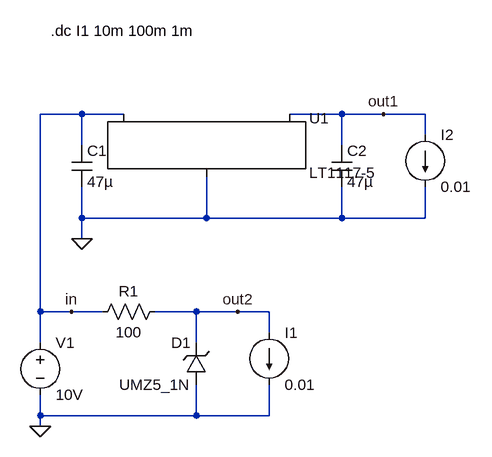
[diagram p0: schematic 08-regulator_vs_zener.asc]
08-regulator_vs_zener.asc, the LTspice schematic file:
Version 4
SHEET 1 880 680
WIRE -16 64 -80 64
WIRE 48 64 -16 64
WIRE 384 64 304 64
WIRE 448 64 384 64
WIRE 512 64 448 64
WIRE 512 96 512 64
WIRE -16 112 -16 64
WIRE 384 112 384 64
WIRE -16 224 -16 176
WIRE 176 224 176 160
WIRE 176 224 -16 224
WIRE 384 224 384 176
WIRE 384 224 176 224
WIRE 512 224 512 176
WIRE 512 224 384 224
WIRE -16 256 -16 224
WIRE -80 368 -80 64
WIRE -32 368 -80 368
WIRE 16 368 -32 368
WIRE 160 368 96 368
WIRE 224 368 160 368
WIRE 272 368 224 368
WIRE 272 400 272 368
WIRE -80 416 -80 368
WIRE 160 416 160 368
WIRE -80 528 -80 496
WIRE 160 528 160 480
WIRE 160 528 -80 528
WIRE 272 528 272 480
WIRE 272 528 160 528
WIRE -80 544 -80 528
FLAG -80 544 0
FLAG -32 368 in
FLAG 448 64 out1
FLAG -16 256 0
FLAG 224 368 out2
SYMBOL res 112 352 R90
WINDOW 0 0 56 VBottom 2
WINDOW 3 32 56 VTop 2
SYMATTR InstName R1
SYMATTR Value 100
SYMBOL voltage -80 400 R0
WINDOW 123 0 0 Left 0
WINDOW 39 0 0 Left 0
SYMATTR InstName V1
SYMATTR Value 10V
SYMBOL zener 176 480 R180
WINDOW 0 24 64 Left 2
WINDOW 3 24 0 Left 2
SYMATTR InstName D1
SYMATTR Value UMZ5_1N
SYMBOL PowerProducts\\LT1117-5 176 64 R0
SYMATTR InstName U1
SYMBOL cap -32 112 R0
SYMATTR InstName C1
SYMATTR Value 47µ
SYMATTR SpiceLine V=16 Irms=2.2 Rser=0.0211 Lser=3.091n mfg="Würth Elektronik" pn="875105344006 WCAP-PSLP 6,3 x 5,8" type="Al polymer"
SYMBOL cap 368 112 R0
SYMATTR InstName C2
SYMATTR Value 47µ
SYMATTR SpiceLine V=16 Irms=2.2 Rser=0.0211 Lser=3.091n mfg="Würth Elektronik" pn="875105344006 WCAP-PSLP 6,3 x 5,8" type="Al polymer"
SYMBOL current 272 400 R0
WINDOW 123 0 0 Left 0
WINDOW 39 0 0 Left 0
SYMATTR InstName I1
SYMATTR Value 0.01
SYMBOL current 512 96 R0
WINDOW 123 0 0 Left 0
WINDOW 39 0 0 Left 0
SYMATTR InstName I2
SYMATTR Value 0.01
TEXT -64 -64 Left 2 !.dc I1 10m 100m 1m

The netlist it stands for:
* 08-regulator_vs_zener.asc
R1 out2 in 100
V1 in 0 10V
D1 0 out2 UMZ5_1N
XU1 0 out1 in LT1117-5
C1 in 0 47µ V=16 Irms=2.2 Rser=0.0211 Lser=3.091n mfg="Würth Elektronik" pn="875105344006 WCAP-PSLP 6,3 x 5,8" type="Al polymer"
C2 out1 0 47µ V=16 Irms=2.2 Rser=0.0211 Lser=3.091n mfg="Würth Elektronik" pn="875105344006 WCAP-PSLP 6,3 x 5,8" type="Al polymer"
I1 out2 0 0.01
I2 out1 0 0.01
.model D D
.lib standard.dio
.dc I1 10m 100m 1m
.backanno
.end

* Results of the author's LTspice run, read from the files saved beside the schematic
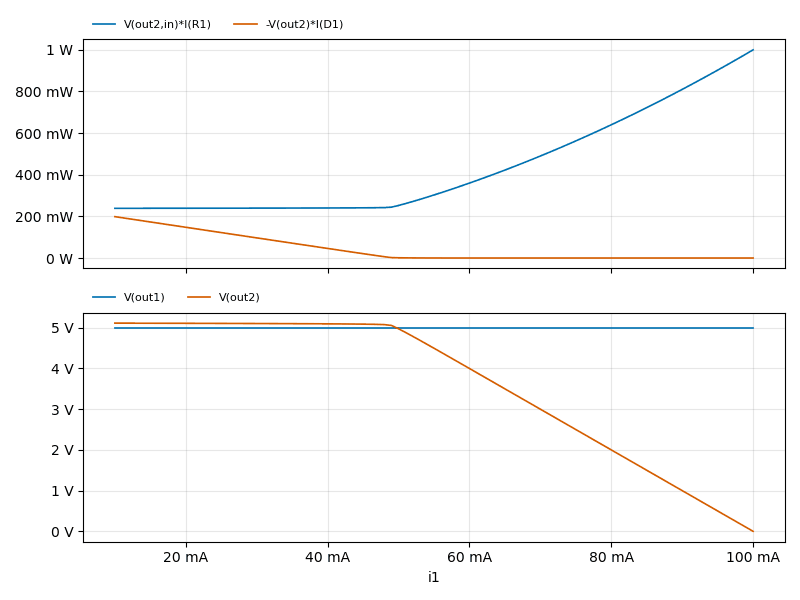
[diagram p1: DC transfer characteristic of 08-regulator_vs_zener.asc, plotted from the saved traces]
* DC transfer characteristic, 1 run:
*   V(out2,in)*I(R1): 238.8 mW at i1=10 mA, 1 W at i1=100 mA, min 238.8 mW, max 1 W
*   -V(out2)*I(D1): 198.7 mW at i1=10 mA, 4.734e-45 fW at i1=100 mA, min 4.734e-45 fW, max 198.7 mW
*   V(out1): 5.003 V at i1=10 mA, 5.003 V at i1=100 mA, min 5.003 V, max 5.003 V
*   V(out2): 5.114 V at i1=10 mA, -2.177e-14 fV at i1=100 mA, min -2.177e-14 fV, max 5.114 V